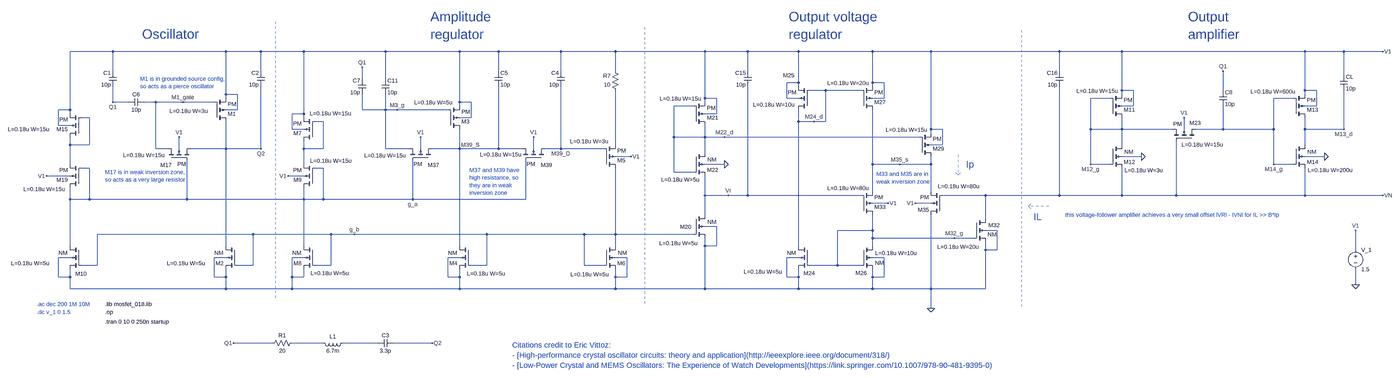
[diagram p0: schematic ck_osc.asc, whole sheet]
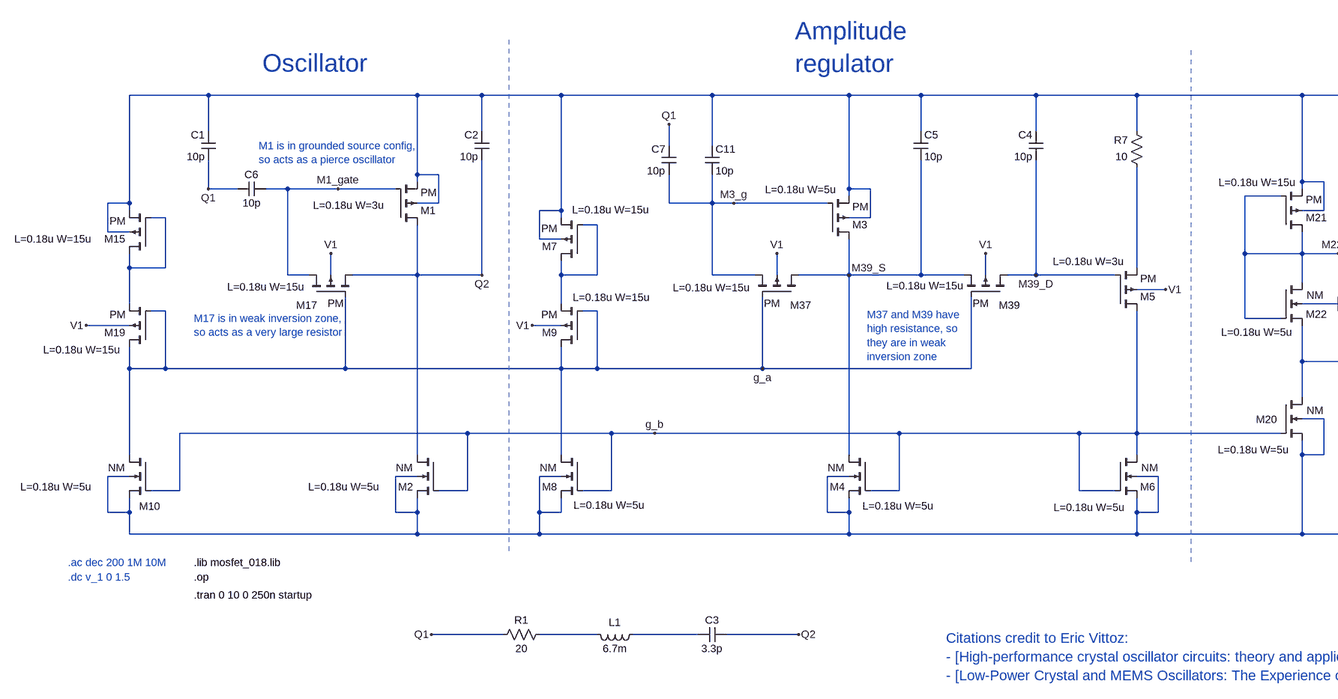
[diagram p1: schematic ck_osc.asc, part, row 1 of 1, column 1 of 2]
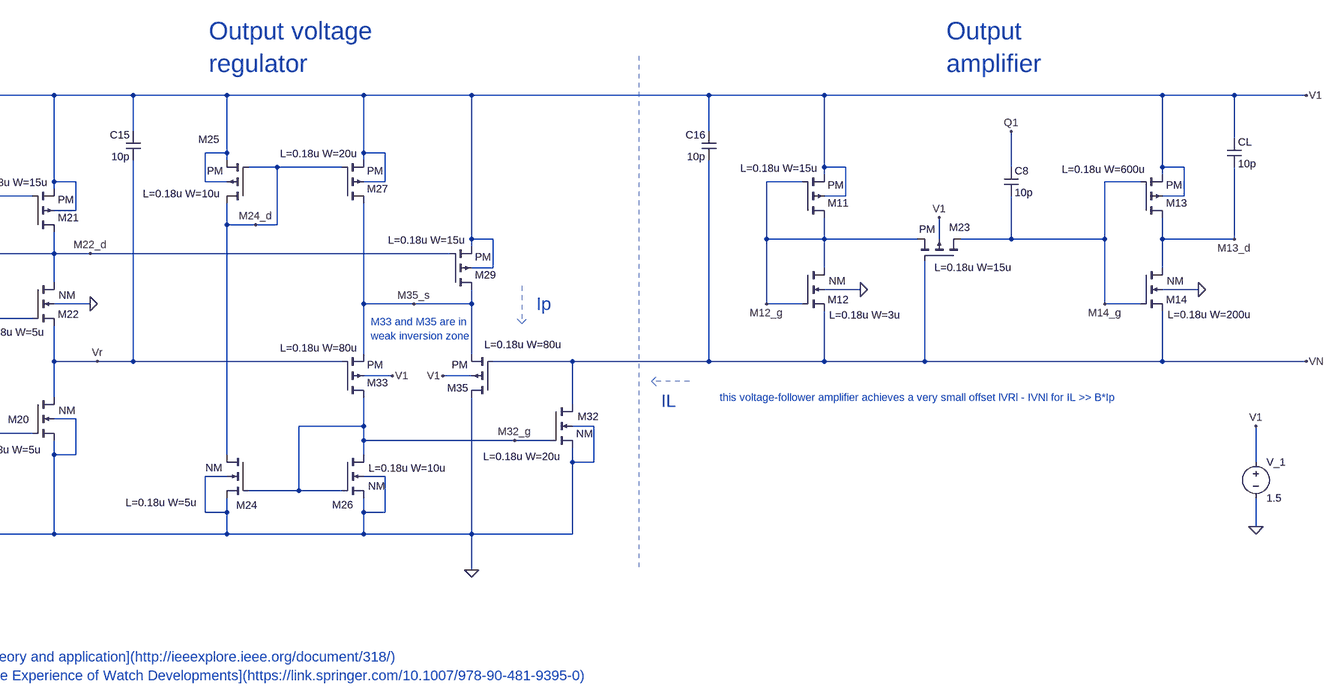
[diagram p2: schematic ck_osc.asc, part, row 1 of 1, column 2 of 2]
ck_osc.asc, the LTspice schematic file:
Version 4
SHEET 1 5612 1000
WIRE 352 -368 176 -368
WIRE 816 -368 352 -368
WIRE 960 -368 816 -368
WIRE 1136 -368 960 -368
WIRE 1472 -368 1136 -368
WIRE 1776 -368 1472 -368
WIRE 1936 -368 1776 -368
WIRE 2192 -368 1936 -368
WIRE 2416 -368 2192 -368
WIRE 2784 -368 2416 -368
WIRE 2960 -368 2784 -368
WIRE 3168 -368 2960 -368
WIRE 3472 -368 3168 -368
WIRE 3712 -368 3472 -368
WIRE 4240 -368 3712 -368
WIRE 4496 -368 4240 -368
WIRE 5248 -368 4496 -368
WIRE 5408 -368 5248 -368
WIRE 5568 -368 5408 -368
WIRE 352 -288 352 -368
WIRE 960 -288 960 -368
WIRE 1936 -288 1936 -368
WIRE 2192 -288 2192 -368
WIRE 2416 -288 2416 -368
WIRE 2960 -288 2960 -368
WIRE 4240 -288 4240 -368
WIRE 5408 -272 5408 -368
WIRE 1376 -256 1376 -304
WIRE 1472 -256 1472 -368
WIRE 3168 -240 3168 -368
WIRE 3168 -240 3120 -240
WIRE 3472 -240 3472 -368
WIRE 3520 -240 3472 -240
WIRE 3168 -224 3168 -240
WIRE 3472 -224 3472 -240
WIRE 3280 -208 3216 -208
WIRE 3424 -208 3280 -208
WIRE 4496 -208 4496 -368
WIRE 4544 -208 4496 -208
WIRE 4912 -208 4912 -288
WIRE 5248 -208 5248 -368
WIRE 5296 -208 5248 -208
WIRE 816 -192 816 -368
WIRE 864 -192 816 -192
WIRE 4496 -192 4496 -208
WIRE 5248 -192 5248 -208
WIRE 816 -176 816 -192
WIRE 2784 -176 2784 -368
WIRE 2832 -176 2784 -176
WIRE 3120 -176 3120 -240
WIRE 3168 -176 3120 -176
WIRE 3520 -176 3520 -240
WIRE 3520 -176 3472 -176
WIRE 4448 -176 4368 -176
WIRE 5200 -176 5120 -176
WIRE 352 -160 352 -224
WIRE 416 -160 352 -160
WIRE 528 -160 480 -160
WIRE 640 -160 528 -160
WIRE 768 -160 640 -160
WIRE 1776 -160 1776 -368
WIRE 1824 -160 1776 -160
WIRE 2784 -160 2784 -176
WIRE 1776 -144 1776 -160
WIRE 2736 -144 2656 -144
WIRE 4544 -144 4544 -208
WIRE 4544 -144 4496 -144
WIRE 5296 -144 5296 -208
WIRE 5296 -144 5248 -144
WIRE 176 -128 176 -368
WIRE 176 -128 128 -128
WIRE 864 -128 864 -192
WIRE 864 -128 816 -128
WIRE 1376 -128 1376 -192
WIRE 1472 -128 1472 -192
WIRE 1472 -128 1376 -128
WIRE 1520 -128 1472 -128
WIRE 1728 -128 1520 -128
WIRE 176 -112 176 -128
WIRE 1136 -112 1136 -368
WIRE 1136 -112 1088 -112
WIRE 2832 -112 2832 -176
WIRE 2832 -112 2784 -112
WIRE 256 -96 224 -96
WIRE 1136 -96 1136 -112
WIRE 1824 -96 1824 -160
WIRE 1824 -96 1776 -96
WIRE 1216 -80 1184 -80
WIRE 3168 -80 3168 -128
WIRE 3232 -80 3168 -80
WIRE 3280 -80 3280 -208
WIRE 3280 -80 3232 -80
WIRE 128 -64 128 -128
WIRE 176 -64 128 -64
WIRE 1088 -48 1088 -112
WIRE 1136 -48 1088 -48
WIRE 3712 -48 3712 -368
WIRE 3760 -48 3712 -48
WIRE 4368 -48 4368 -176
WIRE 4496 -48 4496 -96
WIRE 4496 -48 4368 -48
WIRE 4704 -48 4496 -48
WIRE 4752 -48 4752 -96
WIRE 4912 -48 4912 -144
WIRE 4912 -48 4800 -48
WIRE 5120 -48 5120 -176
WIRE 5120 -48 4912 -48
WIRE 5248 -48 5248 -96
WIRE 5408 -48 5408 -208
WIRE 5408 -48 5248 -48
WIRE 3712 -32 3712 -48
WIRE 2656 -16 2656 -144
WIRE 2784 -16 2784 -64
WIRE 2784 -16 2656 -16
WIRE 2864 -16 2784 -16
WIRE 3664 -16 2864 -16
WIRE 176 16 176 -16
WIRE 256 16 256 -96
WIRE 256 16 176 16
WIRE 2416 16 2416 -208
WIRE 3760 16 3760 -48
WIRE 3760 16 3712 16
WIRE 4496 16 4496 -48
WIRE 5248 16 5248 -48
WIRE 528 32 528 -160
WIRE 576 32 528 32
WIRE 624 32 624 -16
WIRE 816 32 816 -80
WIRE 816 32 672 32
WIRE 960 32 960 -224
WIRE 960 32 816 32
WIRE 1136 32 1136 0
WIRE 1216 32 1216 -80
WIRE 1216 32 1136 32
WIRE 1472 32 1472 -128
WIRE 1568 32 1472 32
WIRE 1616 32 1616 -16
WIRE 1776 32 1776 -48
WIRE 1776 32 1664 32
WIRE 1936 32 1936 -224
WIRE 1936 32 1776 32
WIRE 2032 32 1936 32
WIRE 2080 32 2080 -16
WIRE 2192 32 2192 -224
WIRE 2192 32 2128 32
WIRE 2368 32 2192 32
WIRE 2784 48 2784 -16
WIRE 2480 64 2416 64
WIRE 4576 64 4496 64
WIRE 5328 64 5248 64
WIRE 176 96 176 16
WIRE 1136 96 1136 32
WIRE 2864 96 2784 96
WIRE 3472 96 3472 -128
WIRE 3584 96 3472 96
WIRE 3712 96 3712 64
WIRE 3712 96 3584 96
WIRE 4368 96 4368 -48
WIRE 4448 96 4368 96
WIRE 5120 96 5120 -48
WIRE 5200 96 5120 96
WIRE 256 112 224 112
WIRE 1216 112 1184 112
WIRE 2656 128 2656 -16
WIRE 2736 128 2656 128
WIRE 176 144 80 144
WIRE 1136 144 1072 144
WIRE 3472 208 3472 96
WIRE 3712 208 3712 96
WIRE 2784 224 2784 144
WIRE 2880 224 2784 224
WIRE 2960 224 2960 -224
WIRE 2960 224 2880 224
WIRE 3424 224 2960 224
WIRE 3936 224 3760 224
WIRE 4240 224 4240 -224
WIRE 4240 224 3936 224
WIRE 4496 224 4496 112
WIRE 4496 224 4240 224
WIRE 4720 224 4720 0
WIRE 4720 224 4496 224
WIRE 5248 224 5248 112
WIRE 5248 224 4720 224
WIRE 5568 224 5248 224
WIRE 176 240 176 192
WIRE 256 240 256 112
WIRE 256 240 176 240
WIRE 656 240 656 80
WIRE 656 240 256 240
WIRE 1136 240 1136 192
WIRE 1136 240 656 240
WIRE 1216 240 1216 112
WIRE 1216 240 1136 240
WIRE 1584 240 1584 80
WIRE 1584 240 1216 240
WIRE 2048 240 2048 80
WIRE 2048 240 1584 240
WIRE 3536 256 3472 256
WIRE 3712 256 3648 256
WIRE 2784 304 2784 224
WIRE 3936 320 3936 224
WIRE 2832 352 2784 352
WIRE 3472 368 3472 304
WIRE 3472 368 3328 368
WIRE 3984 368 3936 368
WIRE 928 384 288 384
WIRE 1248 384 928 384
WIRE 1344 384 1248 384
WIRE 1888 384 1344 384
WIRE 2288 384 1888 384
WIRE 2416 384 2416 112
WIRE 2416 384 2288 384
WIRE 2736 384 2416 384
WIRE 3472 400 3472 368
WIRE 3808 400 3472 400
WIRE 3888 400 3808 400
WIRE 176 432 176 240
WIRE 816 432 816 32
WIRE 1136 432 1136 240
WIRE 1776 432 1776 32
WIRE 2416 432 2416 384
WIRE 2784 432 2784 400
WIRE 2832 432 2832 352
WIRE 2832 432 2784 432
WIRE 3168 432 3168 -80
WIRE 3472 432 3472 400
WIRE 3936 448 3936 416
WIRE 3984 448 3984 368
WIRE 3984 448 3936 448
WIRE 5456 448 5456 368
WIRE 176 480 128 480
WIRE 816 480 768 480
WIRE 1136 480 1088 480
WIRE 1776 480 1728 480
WIRE 2464 480 2416 480
WIRE 3168 480 3120 480
WIRE 3520 480 3472 480
WIRE 288 512 288 384
WIRE 288 512 224 512
WIRE 928 512 928 384
WIRE 928 512 864 512
WIRE 1248 512 1248 384
WIRE 1248 512 1184 512
WIRE 1888 512 1888 384
WIRE 1888 512 1824 512
WIRE 2288 512 2288 384
WIRE 2368 512 2288 512
WIRE 3328 512 3328 368
WIRE 3328 512 3216 512
WIRE 3424 512 3328 512
WIRE 128 560 128 480
WIRE 176 560 176 528
WIRE 176 560 128 560
WIRE 768 560 768 480
WIRE 816 560 816 528
WIRE 816 560 768 560
WIRE 1088 560 1088 480
WIRE 1136 560 1136 528
WIRE 1136 560 1088 560
WIRE 1728 560 1728 480
WIRE 1776 560 1776 528
WIRE 1776 560 1728 560
WIRE 2416 560 2416 528
WIRE 2464 560 2464 480
WIRE 2464 560 2416 560
WIRE 3120 560 3120 480
WIRE 3168 560 3168 528
WIRE 3168 560 3120 560
WIRE 3472 560 3472 528
WIRE 3520 560 3520 480
WIRE 3520 560 3472 560
WIRE 5456 592 5456 528
WIRE 176 608 176 560
WIRE 816 608 816 560
WIRE 816 608 176 608
WIRE 1088 608 1088 560
WIRE 1088 608 816 608
WIRE 1776 608 1776 560
WIRE 1776 608 1088 608
WIRE 2416 608 2416 560
WIRE 2416 608 1776 608
WIRE 2784 608 2784 432
WIRE 2784 608 2416 608
WIRE 3168 608 3168 560
WIRE 3168 608 2784 608
WIRE 3472 608 3472 560
WIRE 3472 608 3168 608
WIRE 3712 608 3712 304
WIRE 3712 608 3472 608
WIRE 3936 608 3936 448
WIRE 3936 608 3712 608
WIRE 3712 688 3712 608
WIRE 1008 832 848 832
WIRE 1216 832 1088 832
WIRE 1440 832 1296 832
WIRE 1664 832 1504 832
FLAG 352 -160 Q1
FLAG 960 32 Q2
FLAG 1376 -304 Q1
FLAG 2880 224 Vr
FLAG 4912 -288 Q1
FLAG 3712 688 0
FLAG 5456 592 0
FLAG 5568 -368 V1
FLAG 5568 224 VN
FLAG 5456 368 V1
FLAG 1584 240 g_a
FLAG 1344 384 g_b
FLAG 640 -160 M1_gate
FLAG 1776 32 M39_S
FLAG 2192 32 M39_D
FLAG 1520 -128 M3_g
FLAG 4368 96 M12_g
FLAG 5120 96 M14_g
FLAG 5408 -48 M13_d
FLAG 2864 -16 M22_d
FLAG 3808 400 M32_g
FLAG 3232 -80 M24_d
FLAG 3584 96 M35_s
FLAG 2864 96 0
FLAG 4576 64 0
FLAG 5328 64 0
FLAG 80 144 V1
FLAG 1072 144 V1
FLAG 1616 -16 V1
FLAG 2080 -16 V1
FLAG 2480 64 V1
FLAG 3648 256 V1
FLAG 3536 256 V1
FLAG 4752 -96 V1
FLAG 624 -16 V1
FLAG 848 832 Q1
FLAG 1664 832 Q2
SYMBOL pmos4 224 -16 R180
WINDOW 123 131 32 Left 2
SYMATTR Value2 L=0.18u W=15u
SYMATTR InstName M15
SYMATTR Value PM
SYMATTR Prefix X
SYMBOL pmos4 224 192 R180
WINDOW 123 67 -6 Left 2
SYMATTR Value2 L=0.18u W=15u
SYMATTR InstName M19
SYMATTR Value PM
SYMATTR Prefix X
SYMBOL nmos4 224 432 M0
WINDOW 3 58 29 Left 2
WINDOW 123 131 71 Left 2
WINDOW 0 -21 115 Left 2
SYMATTR Value NM
SYMATTR Value2 L=0.18u W=5u
SYMATTR InstName M10
SYMATTR Prefix X
SYMBOL cap 368 -288 M0
SYMATTR InstName C1
SYMATTR Value 10p
SYMBOL cap 416 -144 R270
WINDOW 0 32 32 VTop 2
WINDOW 3 0 32 VBottom 2
SYMATTR InstName C6
SYMATTR Value 10p
SYMBOL pmos4 576 80 R270
WINDOW 123 22 -182 VRight 2
WINDOW 0 -19 -29 VRight 2
WINDOW 3 -15 41 VRight 2
SYMATTR Value2 L=0.18u W=15u
SYMATTR InstName M17
SYMATTR Value PM
SYMATTR Prefix X
SYMBOL pmos4 768 -80 M180
WINDOW 123 -183 43 Left 2
SYMATTR Value2 L=0.18u W=3u
SYMATTR InstName M1
SYMATTR Value PM
SYMATTR Prefix X
SYMBOL cap 976 -288 M0
SYMATTR InstName C2
SYMATTR Value 10p
SYMBOL nmos4 864 432 M0
WINDOW 3 58 29 Left 2
WINDOW 123 131 71 Left 2
WINDOW 0 56 71 Left 2
SYMATTR Value NM
SYMATTR Value2 L=0.18u W=5u
SYMATTR InstName M2
SYMATTR Prefix X
SYMBOL pmos4 1184 0 R180
WINDOW 123 -149 113 Left 2
SYMATTR Value2 L=0.18u W=15u
SYMATTR InstName M7
SYMATTR Value PM
SYMATTR Prefix X
SYMBOL pmos4 1184 192 R180
WINDOW 123 -151 110 Left 2
SYMATTR Value2 L=0.18u W=15u
SYMATTR InstName M9
SYMATTR Value PM
SYMATTR Prefix X
SYMBOL nmos4 1184 432 M0
WINDOW 3 58 29 Left 2
WINDOW 123 -139 112 Left 2
WINDOW 0 56 71 Left 2
SYMATTR Value NM
SYMATTR Value2 L=0.18u W=5u
SYMATTR InstName M8
SYMATTR Prefix X
SYMBOL pmos4 1664 80 M270
WINDOW 123 20 107 VRight 2
WINDOW 0 -19 -29 VRight 2
WINDOW 3 -15 41 VRight 2
SYMATTR Value2 L=0.18u W=15u
SYMATTR InstName M37
SYMATTR Value PM
SYMATTR Prefix X
SYMBOL cap 1392 -256 M0
SYMATTR InstName C7
SYMATTR Value 10p
SYMBOL cap 1456 -256 R0
SYMATTR InstName C11
SYMATTR Value 10p
SYMBOL pmos4 2128 80 M270
WINDOW 123 24 96 VRight 2
WINDOW 0 -19 -29 VRight 2
WINDOW 3 -15 41 VRight 2
SYMATTR Value2 L=0.18u W=15u
SYMATTR InstName M39
SYMATTR Value PM
SYMATTR Prefix X
SYMBOL pmos4 1728 -48 M180
WINDOW 123 -138 110 Left 2
SYMATTR Value2 L=0.18u W=5u
SYMATTR InstName M3
SYMATTR Value PM
SYMATTR Prefix X
SYMBOL cap 1920 -288 R0
SYMATTR InstName C5
SYMATTR Value 10p
SYMBOL cap 2208 -288 M0
SYMATTR InstName C4
SYMATTR Value 10p
SYMBOL nmos4 1824 432 M0
WINDOW 3 58 29 Left 2
WINDOW 123 -141 114 Left 2
WINDOW 0 56 71 Left 2
SYMATTR Value NM
SYMATTR Value2 L=0.18u W=5u
SYMATTR InstName M4
SYMATTR Prefix X
SYMBOL res 2432 -192 R180
WINDOW 0 36 76 Left 2
WINDOW 3 36 40 Left 2
SYMATTR InstName R7
SYMATTR Value 10
SYMBOL pmos4 2368 112 M180
WINDOW 123 -138 110 Left 2
SYMATTR Value2 L=0.18u W=3u
SYMATTR InstName M5
SYMATTR Value PM
SYMATTR Prefix X
SYMBOL nmos4 2368 432 R0
WINDOW 3 58 29 Left 2
WINDOW 123 -137 117 Left 2
WINDOW 0 56 71 Left 2
SYMATTR Value NM
SYMATTR Value2 L=0.18u W=5u
SYMATTR InstName M6
SYMATTR Prefix X
SYMBOL nmos4 2736 304 R0
WINDOW 3 58 29 Left 2
WINDOW 123 -140 117 Left 2
WINDOW 0 -55 49 Left 2
SYMATTR Value NM
SYMATTR Value2 L=0.18u W=5u
SYMATTR InstName M20
SYMATTR Prefix X
SYMBOL nmos4 3216 432 M0
WINDOW 3 58 29 Left 2
WINDOW 123 114 106 Left 2
WINDOW 0 -20 112 Left 2
SYMATTR Value NM
SYMATTR Value2 L=0.18u W=5u
SYMATTR InstName M24
SYMATTR Prefix X
SYMBOL pmos4 2736 -64 M180
WINDOW 123 -138 110 Left 2
SYMATTR Value2 L=0.18u W=15u
SYMATTR InstName M21
SYMATTR Value PM
SYMATTR Prefix X
SYMBOL nmos4 2736 48 R0
WINDOW 3 58 29 Left 2
WINDOW 123 -132 111 Left 2
WINDOW 0 56 71 Left 2
SYMATTR Value NM
SYMATTR Value2 L=0.18u W=5u
SYMATTR InstName M22
SYMATTR Prefix X
SYMBOL cap 2976 -288 M0
SYMATTR InstName C15
SYMATTR Value 10p
SYMBOL pmos4 3424 304 M180
WINDOW 123 -138 110 Left 2
SYMATTR Value2 L=0.18u W=80u
SYMATTR InstName M33
SYMATTR Value PM
SYMATTR Prefix X
SYMBOL pmos4 3216 -128 R180
WINDOW 123 62 21 Left 2
WINDOW 0 64 142 Left 2
SYMATTR Value2 L=0.18u W=10u
SYMATTR InstName M25
SYMATTR Value PM
SYMATTR Prefix X
SYMBOL pmos4 3424 -128 M180
WINDOW 123 -138 110 Left 2
SYMATTR Value2 L=0.18u W=20u
SYMATTR InstName M27
SYMATTR Value PM
SYMATTR Prefix X
SYMBOL nmos4 3424 432 R0
WINDOW 3 58 70 Left 2
WINDOW 123 59 30 Left 2
WINDOW 0 -22 111 Left 2
SYMATTR Value NM
SYMATTR Value2 L=0.18u W=10u
SYMATTR InstName M26
SYMATTR Prefix X
SYMBOL pmos4 3664 64 M180
WINDOW 123 -138 110 Left 2
SYMATTR Value2 L=0.18u W=15u
SYMATTR InstName M29
SYMATTR Value PM
SYMATTR Prefix X
SYMBOL pmos4 3760 304 R180
WINDOW 123 -153 117 Left 2
WINDOW 0 55 21 Left 2
SYMATTR Value2 L=0.18u W=80u
SYMATTR InstName M35
SYMATTR Value PM
SYMATTR Prefix X
SYMBOL nmos4 3888 320 R0
WINDOW 3 57 65 Left 2
WINDOW 123 -150 116 Left 2
WINDOW 0 60 27 Left 2
SYMATTR Value NM
SYMATTR Value2 L=0.18u W=20u
SYMATTR InstName M32
SYMATTR Prefix X
SYMBOL cap 4256 -288 M0
SYMATTR InstName C16
SYMATTR Value 10p
SYMBOL pmos4 4448 -96 M180
WINDOW 123 -138 110 Left 2
SYMATTR Value2 L=0.18u W=15u
SYMATTR InstName M11
SYMATTR Value PM
SYMATTR Prefix X
SYMBOL nmos4 4448 16 R0
WINDOW 3 58 29 Left 2
WINDOW 123 59 105 Left 2
WINDOW 0 56 71 Left 2
SYMATTR Value NM
SYMATTR Value2 L=0.18u W=3u
SYMATTR InstName M12
SYMATTR Prefix X
SYMBOL pmos4 4800 0 M270
WINDOW 123 -15 59 VLeft 2
WINDOW 0 74 26 VLeft 2
WINDOW 3 70 93 VLeft 2
SYMATTR Value2 L=0.18u W=15u
SYMATTR InstName M23
SYMATTR Value PM
SYMATTR Prefix X
SYMBOL cap 4896 -208 R0
SYMATTR InstName C8
SYMATTR Value 10p
SYMBOL pmos4 5200 -96 M180
WINDOW 123 -175 107 Left 2
SYMATTR Value2 L=0.18u W=600u
SYMATTR InstName M13
SYMATTR Value PM
SYMATTR Prefix X
SYMBOL nmos4 5200 16 R0
WINDOW 3 58 29 Left 2
WINDOW 123 60 104 Left 2
WINDOW 0 56 71 Left 2
SYMATTR Value NM
SYMATTR Value2 L=0.18u W=200u
SYMATTR InstName M14
SYMATTR Prefix X
SYMBOL cap 5392 -272 R0
SYMATTR InstName CL
SYMATTR Value 10p
SYMBOL voltage 5456 432 R0
SYMATTR InstName V_1
SYMATTR Value 1.5
SYMBOL Ind 1312 816 R90
WINDOW 0 5 56 VBottom 2
WINDOW 3 32 56 VTop 2
SYMATTR InstName L1
SYMATTR Value 6.7m
SYMBOL Res 1104 816 R90
WINDOW 0 0 56 VBottom 2
WINDOW 3 32 56 VTop 2
SYMATTR InstName R1
SYMATTR Value 20
SYMBOL Cap 1504 816 R90
WINDOW 0 0 32 VBottom 2
WINDOW 3 32 32 VTop 2
SYMATTR InstName C3
SYMATTR Value 3.3p
TEXT 40 672 Left 2 ;.ac dec 200 1M 10M
TEXT 320 704 Left 2 !.op
TEXT 320 672 Left 2 !.lib mosfet_018.lib
TEXT 40 704 Left 2 ;.dc v_1 0 1.5
TEXT 472 -440 Left 5 ;Oscillator
TEXT 1656 -512 Left 5 ;Amplitude\nregulator
TEXT 3128 -512 Left 5 ;Output voltage\nregulator
TEXT 4768 -512 Left 5 ;Output\namplifier
TEXT 3488 136 Left 2 ;M33 and M35 are in\nweak inversion zone
TEXT 320 128 Left 2 ;M17 is in weak inversion zone,\nso acts as a very large resistor
TEXT 464 -256 Left 2 ;M1 is in grounded source config,\nso acts as a pierce oscillator
TEXT 1816 120 Left 2 ;M37 and M39 have\nhigh resistance, so\nthey are in weak\ninversion zone
TEXT 3856 96 Left 4 ;Ip
TEXT 4168 312 Right 4 ;IL
TEXT 4264 304 Left 2 ;this voltage-follower amplifier achieves a very small offset lVRl - IVNl for IL >> B*Ip
TEXT 320 744 Left 2 !.tran 0 10 0 250n startup
TEXT 1992 840 Left 3 ;Citations credit to Eric Vittoz:\n- [High-performance crystal oscillator circuits: theory and application](http://ieeexplore.ieee.org/document/318/)\n- [Low-Power Crystal and MEMS Oscillators: The Experience of Watch Developments](https://link.springer.com/10.1007/978-90-481-9395-0)
LINE Normal 1020 -492 1020 656 2
LINE Normal 2536 -468 2536 680 2
LINE Normal 4084 -456 4084 692 2
LINE Normal 3824 56 3824 140 2
LINE Normal 3824 140 3804 120 2
LINE Normal 3824 140 3844 120 2
LINE Normal 4196 268 4112 268 2
LINE Normal 4112 268 4132 248 2
LINE Normal 4112 268 4132 288 2

The netlist it stands for:
* ck_osc.asc
XM15 N001 N001 V1 V1 PM L=0.18u W=15u  ; pins D G S B
XM19 g_a g_a N001 V1 PM L=0.18u W=15u  ; pins D G S B
XM10 g_a g_b 0 0 NM L=0.18u W=5u  ; pins D G S B
C1 V1 Q1 10p
C6 Q1 M1_gate 10p
XM17 M1_gate g_a Q2 V1 PM L=0.18u W=15u  ; pins D G S B
XM1 Q2 M1_gate V1 V1 PM L=0.18u W=3u  ; pins D G S B
C2 V1 Q2 10p
XM2 Q2 g_b 0 0 NM L=0.18u W=5u  ; pins D G S B
XM7 N002 N002 V1 V1 PM L=0.18u W=15u  ; pins D G S B
XM9 g_a g_a N002 V1 PM L=0.18u W=15u  ; pins D G S B
XM8 g_a g_b 0 0 NM L=0.18u W=5u  ; pins D G S B
XM37 M39_S g_a M3_g V1 PM L=0.18u W=15u  ; pins D G S B
C7 Q1 M3_g 10p
C11 V1 M3_g 10p
XM39 M39_D g_a M39_S V1 PM L=0.18u W=15u  ; pins D G S B
XM3 M39_S M3_g V1 V1 PM L=0.18u W=5u  ; pins D G S B
C5 V1 M39_S 10p
C4 V1 M39_D 10p
XM4 M39_S g_b 0 0 NM L=0.18u W=5u  ; pins D G S B
R7 N003 V1 10
XM5 g_b M39_D N003 V1 PM L=0.18u W=3u  ; pins D G S B
XM6 g_b g_b 0 0 NM L=0.18u W=5u  ; pins D G S B
XM20 Vr g_b 0 0 NM L=0.18u W=5u  ; pins D G S B
XM24 M24_d M32_g 0 0 NM L=0.18u W=5u  ; pins D G S B
XM21 M22_d M22_d V1 V1 PM L=0.18u W=15u  ; pins D G S B
XM22 M22_d M22_d Vr 0 NM L=0.18u W=5u  ; pins D G S B
C15 V1 Vr 10p
XM33 M32_g Vr M35_s V1 PM L=0.18u W=80u  ; pins D G S B
XM25 M24_d M24_d V1 V1 PM L=0.18u W=10u  ; pins D G S B
XM27 M35_s M24_d V1 V1 PM L=0.18u W=20u  ; pins D G S B
XM26 M32_g M32_g 0 0 NM L=0.18u W=10u  ; pins D G S B
XM29 M35_s M22_d V1 V1 PM L=0.18u W=15u  ; pins D G S B
XM35 0 VN M35_s V1 PM L=0.18u W=80u  ; pins D G S B
XM32 VN M32_g 0 0 NM L=0.18u W=20u  ; pins D G S B
C16 V1 VN 10p
XM11 M12_g M12_g V1 V1 PM L=0.18u W=15u  ; pins D G S B
XM12 M12_g M12_g VN 0 NM L=0.18u W=3u  ; pins D G S B
XM23 M14_g VN M12_g V1 PM L=0.18u W=15u  ; pins D G S B
C8 Q1 M14_g 10p
XM13 M13_d M14_g V1 V1 PM L=0.18u W=600u  ; pins D G S B
XM14 M13_d M14_g VN 0 NM L=0.18u W=200u  ; pins D G S B
CL V1 M13_d 10p
V_1 V1 0 1.5
L1 N005 N004 6.7m
R1 N004 Q1 20
C3 Q2 N005 3.3p
* .ac dec 200 1M 10M
.op
.lib mosfet_018.lib
* .dc v_1 0 1.5
* Oscillator
* Amplitude
* regulator
* Output voltage
* regulator
* Output
* amplifier
* M33 and M35 are in
* weak inversion zone
* M17 is in weak inversion zone,
* so acts as a very large resistor
* M1 is in grounded source config,
* so acts as a pierce oscillator
* M37 and M39 have
* high resistance, so
* they are in weak
* inversion zone
* Ip
* IL
* this voltage-follower amplifier achieves a very small offset lVRl - IVNl for IL >> B*Ip
.tran 0 10 0 250n startup
* Citations credit to Eric Vittoz:
* - [High-performance crystal oscillator circuits: theory and application](http://ieeexplore.ieee.org/document/318/)
* - [Low-Power Crystal and MEMS Oscillators: The Experience of Watch Developments](https://link.springer.com/10.1007/978-90-481-9395-0)
.backanno
.end